# EAGLE design 1DD-17-mk-1.1 (EAGLE 7.5.0)
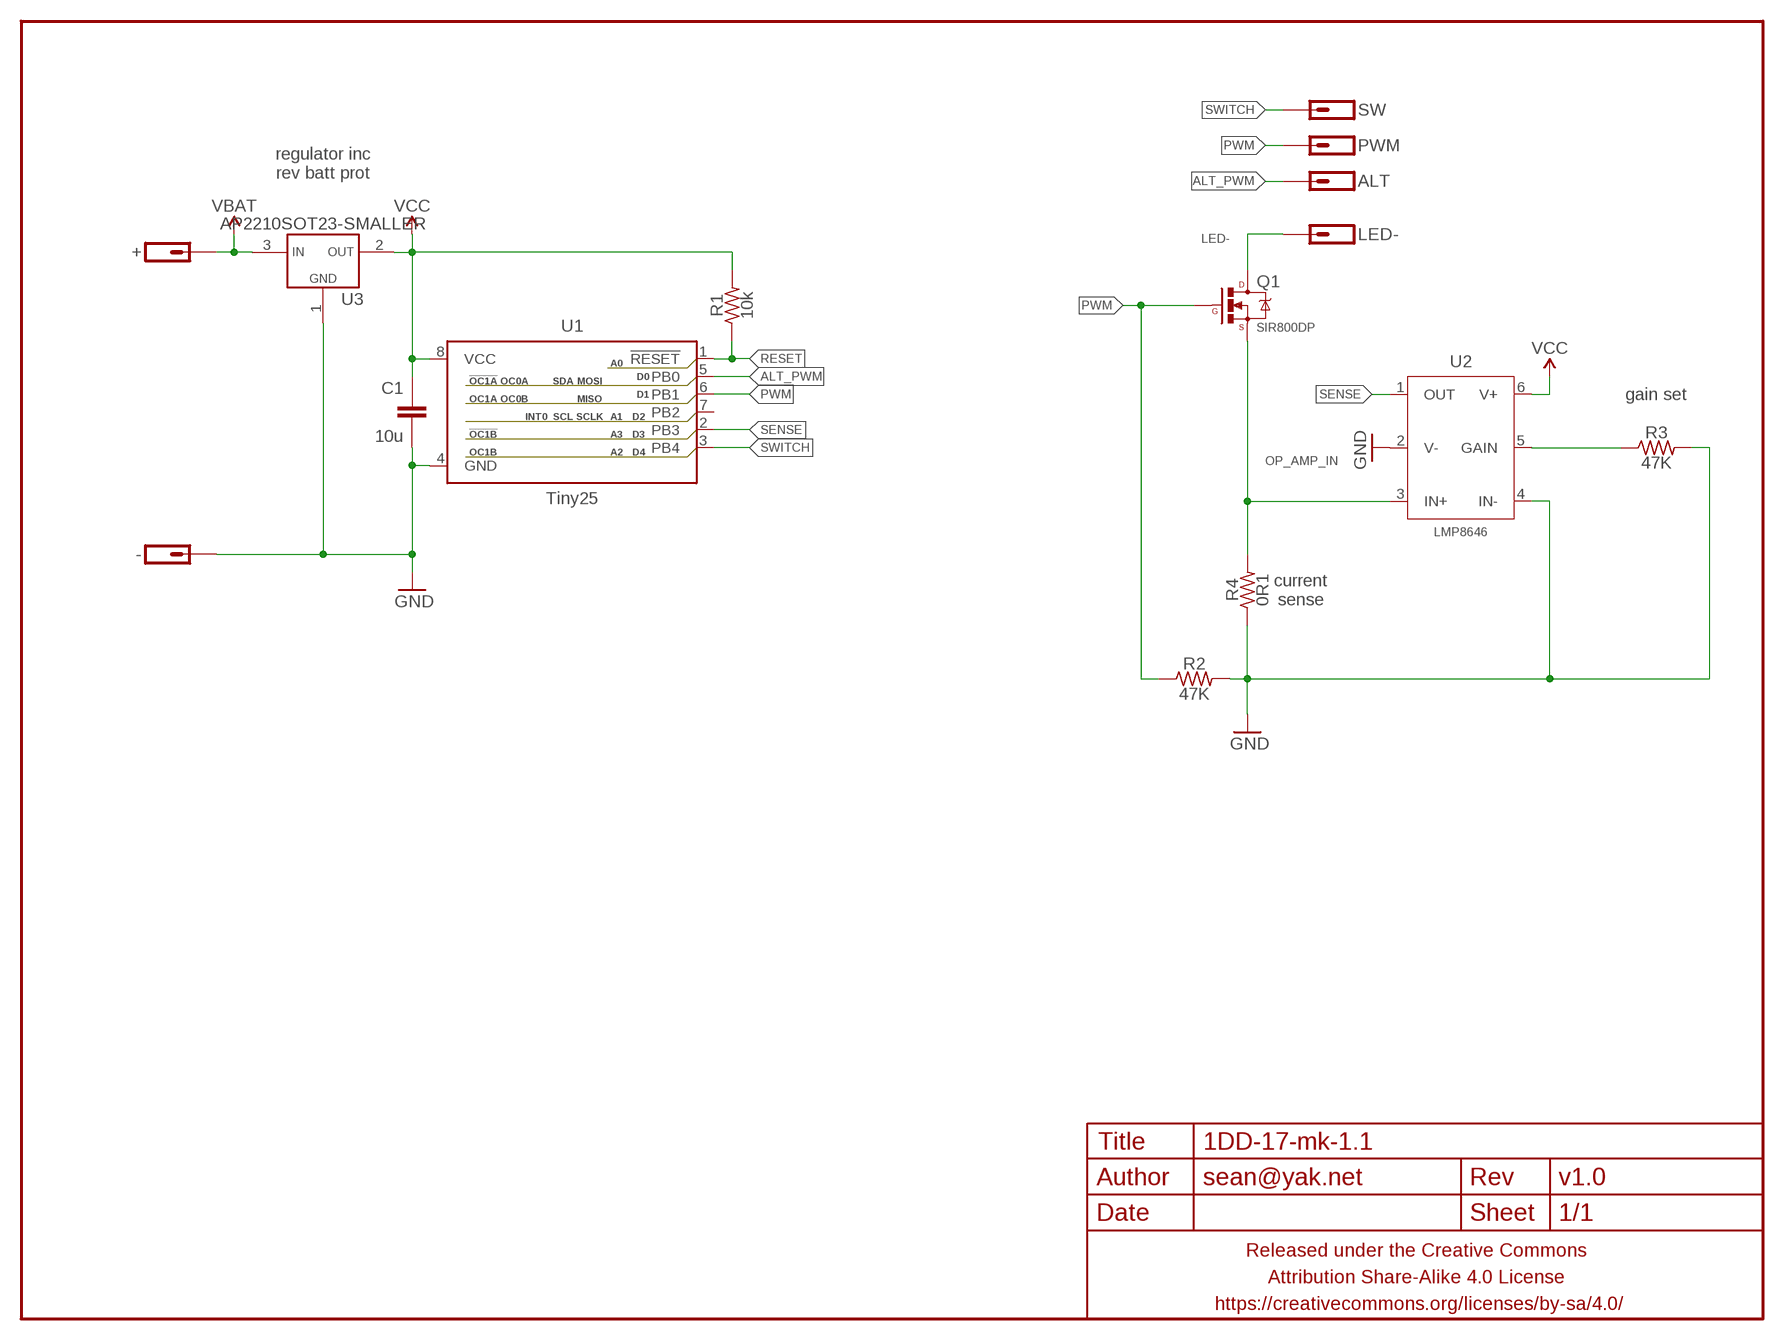
[diagram p0: schematic, sheet 1]

## Parts
+  M01PTH-1MM-CIR-NS  [1X01-1MM-CIR-NS]
-  M01NOT-A-VIA-NOPE  [1X01_NOSILK_NOSTOP]
ALT  M01SMD-1MM-DIA-NS  [1X01-SMD-1MM-DIA-NS]
C1  10u  CAPACITOR-CERAMICC0603-TIGHTER  [C0603-TIGHTER]
FRAME1  FRAME-LETTERNO_PACKAGE  [DUMMY]
LED-  M011X01-0.9MM-CIR  [1X01-0.9MM-CIR]
PWM  M01SMD-1MM-DIA-NS  [1X01-SMD-1MM-DIA-NS]
Q1  SIR800DP  MOSFET-NCHANNELSIR800DP  [POWERPACK-SO-8]
R1  10k  RESISTORR0402  [R0402]
R2  47K  RESISTORR0402  [R0402]
R3  47K  RESISTORR0402  [R0402]
R4  0R1  RESISTORR1206  [R1206]
SW  M01SMD-1MM-DIA-NS  [1X01-SMD-1MM-DIA-NS]
U1  Tiny25  ATTINY13SOIC-NARROWPADS  [SO08-NARROWER]
U2  LMP8646  LMP8646DDC  [SOT23-6]
U3  AP2210SOT23-SMALLER  [SOT23-3]

## Nets
ALT_PWM: ALT.P$1 U1.5(PB0)
GND: -.P$1 C1.2 R2.2 R3.2 R4.1 U1.4(GND) U2.2(V-) U2.4(IN-) U3.1(GND)
LED-: LED-.P$1 Q1.5678(D)
N$1: R3.1 U2.5(GAIN)
OP_AMP_IN: Q1.1(S) Q1.2(S) Q1.3(S) R4.2 U2.3(IN+)
PWM: PWM.P$1 Q1.4(G) R2.1 U1.6(PB1)
RESET: R1.1 U1.1(!RESET)
SENSE: U1.2(PB3) U2.1(OUT)
SWITCH: SW.P$1 U1.3(PB4)
VBAT: +.1 U3.3(VIN)
VCC: C1.1 R1.2 U1.8(VCC) U2.6(V+) U3.2(VOUT)
Unconnected: U1.7(PB2)

## Notes on the sheet
- regulator inc
  rev batt prot
- gain set
- current
  sense

## Library data of the parts
+ - ALT LED- PWM SW = a_parts:M01: Header 1 Standard 1-pin 0.1" header. Use with straight break away headers (SKU : PRT-00116), right angle break away headers (PRT-00553), swiss pins (PRT-00743), machine pins (PRT-00117), and female headers (PRT-00115).
C1 = a_parts:CAPACITOR-CERAMIC: CAPACITOR, European symbol
FRAME1 = a_parts:FRAME-LETTER: Schematic Frame Standard 8.5x11 US Letter frame; DESIGNER: sean@yak.net; VERSION: v1.0
Q1 = a_parts:MOSFET-NCHANNEL: Common NMOSFET Parts MFG P/N Store ID Prod ID FDD8780 TRANS-09984 SI7820DN TRANS-11055 FDS6630A IC-08089 2N7002PW TRANS-11151 FQP30N06L COM-10213 TRANS-10060 BSS123LT1G TRANS-08345 BSS138 TRANS-00830 BS170 2N7000
R1-R4 = a_parts:RESISTOR: RESISTOR, American symbol
U1 = a_parts:ATTINY13: Atmel 8-pin 1kB flash uC
U2 = a_parts:LMP8646
U3 = a_parts:AP2210

## Board
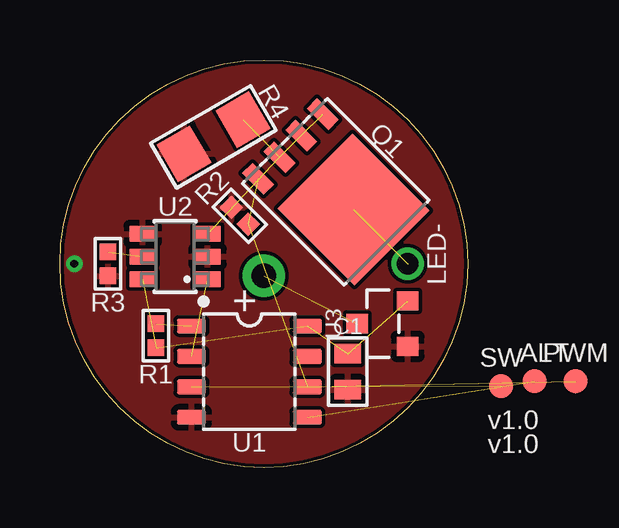
[diagram p1: board, top side]
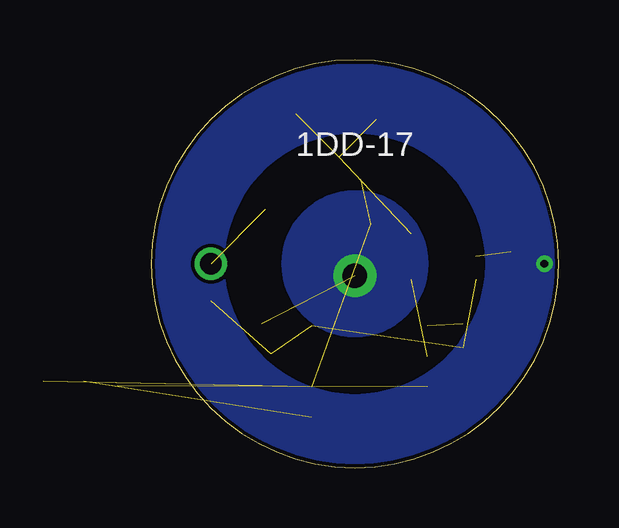
[diagram p2: board, bottom side, seen from below]

Size 17 x 17 mm. Coordinates in mm from the lower left corner, seen from the top.
Outline: 0,8.5 arc-180 17,8.5 arc-180 0,8.5
Copper layers (1*16): Top 0.0356mm / dielectric 1.5011mm / Bottom 0.0356mm
Design rules "LaenPCBOrder2 *": minimum track width 6mil, minimum drill 13mil, track to track 6mil, track to pad 6mil, pad to pad 6mil, via to via 6mil, smd to smd 6mil, copper to edge 6mil, drill to drill 6mil, minimum pad ring 7mil, minimum via ring 7mil, stop-mask expansion 3mil, vias tented up to drill 20mil, thermal gap 10mil

### Footprints (pad centres in the part's own frame; a part is rotated, then mirrored left to right if it is on the bottom)
1X01-1MM-CIR-NS = drill 1.016 pad 1.778: 1 0,0
1X01_NOSILK_NOSTOP = drill 0.33: P$1 0,0
1X01-SMD-1MM-DIA-NS = smd 1 x 1: P$1 0,0
C0603-TIGHTER = smd 0.8 x 1.1: 1 -0.75,0; 2 0.75,0
1X01-0.9MM-CIR = drill 0.9 pad 1.3: P$1 0,0
POWERPACK-SO-8 = smd 1.27 x 0.61: 1 -2.67,1.905; 2 -2.67,0.635; 3 -2.67,-0.635; 4 -2.67,-1.905 | smd 4.52 x 4.42: 5678 1.045,0
R0402 = smd 0.7 x 0.7: 1 -0.5,0; 2 0.5,0
R1206 = smd 1.6 x 1.8: 1 -1.42,0; 2 1.42,0
SO08-NARROWER = smd 0.6 x 1.2: 1 -1.905,-2.416; 2 -0.635,-2.416; 3 0.635,-2.416; 4 1.905,-2.416; 5 1.905,2.416; 6 0.635,2.416; 7 -0.635,2.416; 8 -1.905,2.416
SOT23-6 = smd 0.65 x 1.1: 1 -0.95,-1.35; 2 0,-1.35; 3 0.95,-1.35; 4 0.95,1.35; 5 0,1.35; 6 -0.95,1.35
SOT23-3 = smd 0.8 x 0.9: 1 -0.95,-1; 2 0.95,-1; 3 0,1.1

### Placement (x,y rotation side)
+  8.5,8 0 top
-  0.6,8.5 90 bottom
ALT  19.8,3.6 0 top
C1  12,4 270 top
FRAME1  0,0 0 top
LED-  14.5,8.5 180 top
PWM  21.5,3.6 0 top  (outside the outline)
Q1  11.5,11.5 315 top
R1  4,5.5 270 top
R2  7.5,10.5 135 top
R3  2,8.5 270 top
R4  6.4,13.8 30 top
SW  18.4,3.4 0 top
U1  7.9,4 270 top
U2  4.8,8.8 90 top
U3  13.5,6 90 top

### Tracks (layer width: path | path; a pad name or v marks a point on that pad's centre or on a via)
ALT_PWM  (1 unrouted)
GND
  pour Bottom (isolate 0.152, rank 6, no thermals): 0,8.5 3,8.5 arc90 8.5,3 arc90 14,8.5 17,8.5 arc-90 8.5,0 arc-90
  pour Top (isolate 0.152, rank 6): 17,0 17,17 0,17 0,0
  pour Bottom (isolate 0.152, rank 6, no thermals): 17,8.5 14,8.5 arc90 8.5,14 arc90 3,8.5 0,8.5 arc-90 8.5,17 arc-90
LED-  (1 unrouted)
N$1  (1 unrouted)
OP_AMP_IN  (4 unrouted)
PWM  (3 unrouted)
RESET  (1 unrouted)
SENSE  (1 unrouted)
SWITCH  (1 unrouted)
VBAT  (1 unrouted)
  pour Bottom (isolate 0.152, no thermals): 5.5,8.5 arc-180 11.5,8.5 arc-180
VCC  (4 unrouted)

### Text on the board
bPlace: 1DD-17